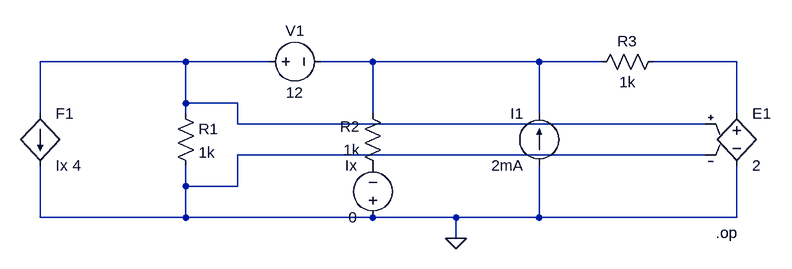
[diagram p0: schematic Draft5.asc]
Draft5.asc, the LTspice schematic file:
Version 4
SHEET 1 1120 680
WIRE 192 80 -32 80
WIRE 320 80 192 80
WIRE 480 80 400 80
WIRE 736 80 480 80
WIRE 832 80 736 80
WIRE 1040 80 912 80
WIRE 192 144 192 80
WIRE 272 144 192 144
WIRE -32 160 -32 80
WIRE 192 160 192 144
WIRE 480 160 480 80
WIRE 736 160 736 80
WIRE 1040 160 1040 80
WIRE 272 176 272 144
WIRE 992 176 272 176
WIRE 992 224 272 224
WIRE 192 272 192 240
WIRE 272 272 272 224
WIRE 272 272 192 272
WIRE -32 320 -32 240
WIRE 192 320 192 272
WIRE 192 320 -32 320
WIRE 480 320 192 320
WIRE 608 320 480 320
WIRE 736 320 736 240
WIRE 736 320 608 320
WIRE 1040 320 1040 240
WIRE 1040 320 736 320
WIRE 608 352 608 320
FLAG 608 352 0
SYMBOL f -32 160 R0
SYMATTR InstName F1
SYMATTR Value Ix 4
SYMBOL res 176 144 R0
SYMATTR InstName R1
SYMATTR Value 1k
SYMBOL voltage 304 80 R270
WINDOW 0 32 56 VTop 2
WINDOW 3 -32 56 VBottom 2
SYMATTR InstName V1
SYMATTR Value 12
SYMBOL res 496 256 R180
WINDOW 0 36 76 Left 2
WINDOW 3 36 40 Left 2
SYMATTR InstName R2
SYMATTR Value 1k
SYMBOL current 736 240 R180
WINDOW 0 24 80 Left 2
WINDOW 3 24 0 Left 2
SYMATTR InstName I1
SYMATTR Value 2mA
SYMBOL res 928 64 R90
WINDOW 0 0 56 VBottom 2
WINDOW 3 32 56 VTop 2
SYMATTR InstName R3
SYMATTR Value 1k
SYMBOL e 1040 144 R0
SYMATTR InstName E1
SYMATTR Value 2
SYMBOL voltage 480 336 R180
WINDOW 0 24 96 Left 2
WINDOW 3 24 16 Left 2
SYMATTR InstName Ix
SYMATTR Value 0
TEXT 1008 344 Left 2 !.op

The netlist it stands for:
* Draft5.asc
F1 N001 0 Ix 4
R1 N001 0 1k
V1 N001 N002 12
R2 P001 N002 1k
I1 0 N002 2mA
R3 N003 N002 1k
E1 N003 0 N001 0 2
V§Ix 0 P001 0
.op
.backanno
.end